# Altium schematic sheet Pasa Altos.SchDoc
size A4
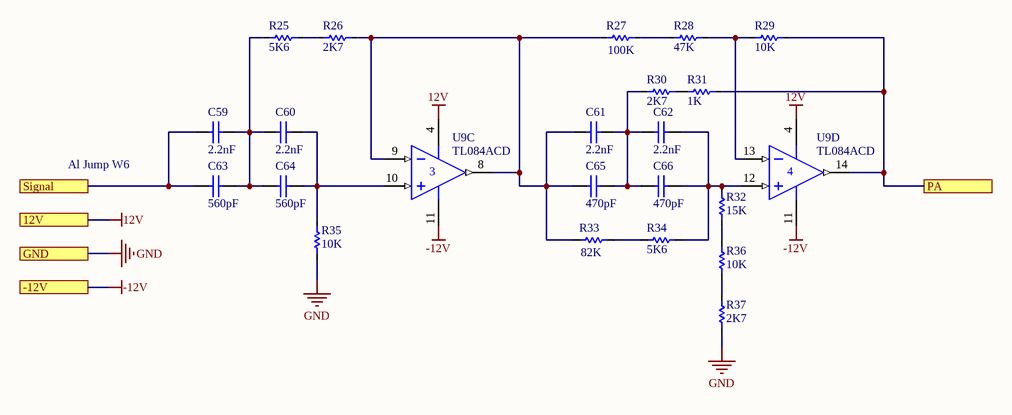
[diagram p0: Pasa Altos.SchDoc]

## Parts
C59  VALOR: 2.2nF  [cap 10]  (hidden comment: Cap Ceramico Disco)
C60  VALOR: 2.2nF  [cap 10]  (hidden comment: Cap Ceramico Disco)
C61  VALOR: 2.2nF  [cap 10]  (hidden comment: Cap Ceramico Disco)
C62  VALOR: 2.2nF  [cap 10]  (hidden comment: Cap Ceramico Disco)
C63  VALOR: 560pF  [CAP DISCO 200mil]  (hidden comment: Cap Ceramico Disco)
C64  VALOR: 560pF  [CAP DISCO 200mil]  (hidden comment: Cap Ceramico Disco)
C65  VALOR: 470pF  [cap 10]  (hidden comment: Cap Ceramico Disco)
C66  VALOR: 470pF  [cap 10]  (hidden comment: Cap Ceramico Disco)
R25  VALOR: 5K6  [1206 resistor]  (hidden comment: Res SMD)
R26  VALOR: 2K7  [1206 resistor]  (hidden comment: Res SMD)
R27  VALOR: 100K  [RES AXIAL 400mil]  (hidden comment: Res SMD)
R28  VALOR: 47K  [1206 resistor]  (hidden comment: Res SMD)
R29  VALOR: 10K  [1206 resistor]  (hidden comment: Res SMD)
R30  VALOR: 2K7  [1206 resistor]  (hidden comment: Res SMD)
R31  VALOR: 1K  [1206 resistor]  (hidden comment: Res SMD)
R32  VALOR: 15K  [1206 resistor]  (hidden comment: Res SMD)
R33  VALOR: 82K  [RES AXIAL 400mil]  (hidden comment: Res SMD)
R34  VALOR: 5K6  [1206 resistor]  (hidden comment: Res SMD)
R35  VALOR: 10K  [1206 resistor]  (hidden comment: Res SMD)
R36  VALOR: 10K  [1206 resistor]  (hidden comment: Res SMD)
R37  VALOR: 2K7  [1206 resistor]  (hidden comment: Res SMD)
U9  TL084ACD  [751A-02_N]  (parts C,D of 4)

## Ports
12V, -12V, GND, PA, Signal

## Nets
12V: U9.4(V+) ; port 12V
-12V: U9.11(V-) ; port -12V
GND: R35.1 R37.2 ; port GND
PA: R29.1 R31.1 U9.14(OUT) ; port PA
Signal: C59.2 C63.2 ; port Signal
NetC59_1: C59.1 C60.2 C63.1 C64.2 R25.2
NetC60_1: C60.1 C64.1 R35.2 U9.10(IN+)
NetC61_1: C61.1 C62.2 C65.1 C66.2 R30.2
NetC61_2: C61.2 C65.2 R26.1 R27.1 R33.1 U9.8(OUT) U9.9(IN-)
NetC62_1: C62.1 C66.1 R32.1 R34.1 U9.12(IN+)
NetR25_1: R25.1 R26.2
NetR27_2: R27.2 R28.2
NetR28_1: R28.1 R29.2 U9.13(IN-)
NetR30_1: R30.1 R31.2
NetR32_2: R32.2 R36.1
NetR33_2: R33.2 R34.2
NetR36_2: R36.2 R37.1

## Notes on the sheet
- Al Jump W6

## Library data of the parts
C59-C66 = Cap Ceramico Disco: Capacitor Ceramico de Insercion; FABRICANTE: Generico; CODIGO STI: *; PROVEEDOR: *
U9 = TL084ACD: JFET-Input Operational Amplifier; Published: 17-Jul-2002; LatestRevisionDate: 13-Apr-2006; LatestRevisionNote: IPC-7351 Footprint Added.; DatasheetVersion: 1988; PackageVersion: 1991; PackageReference: 751A-02; Publisher: Altium Limited; PackageDescription: 14-Pin Small Outline Integrated Circuit 1.27 mm Pitch; Code_IPC: SOIC127P600-14; ComponentLink1Description: Manufacturer Link; ComponentLink1URL: http://www.onsemi.com/site/products/parametrics/0,4446,251,00.html
R25-R37 = Res SMD: CODIGO STI: *; PROVEEDOR: *; FABRICANTE: *; PART NUMBER: *